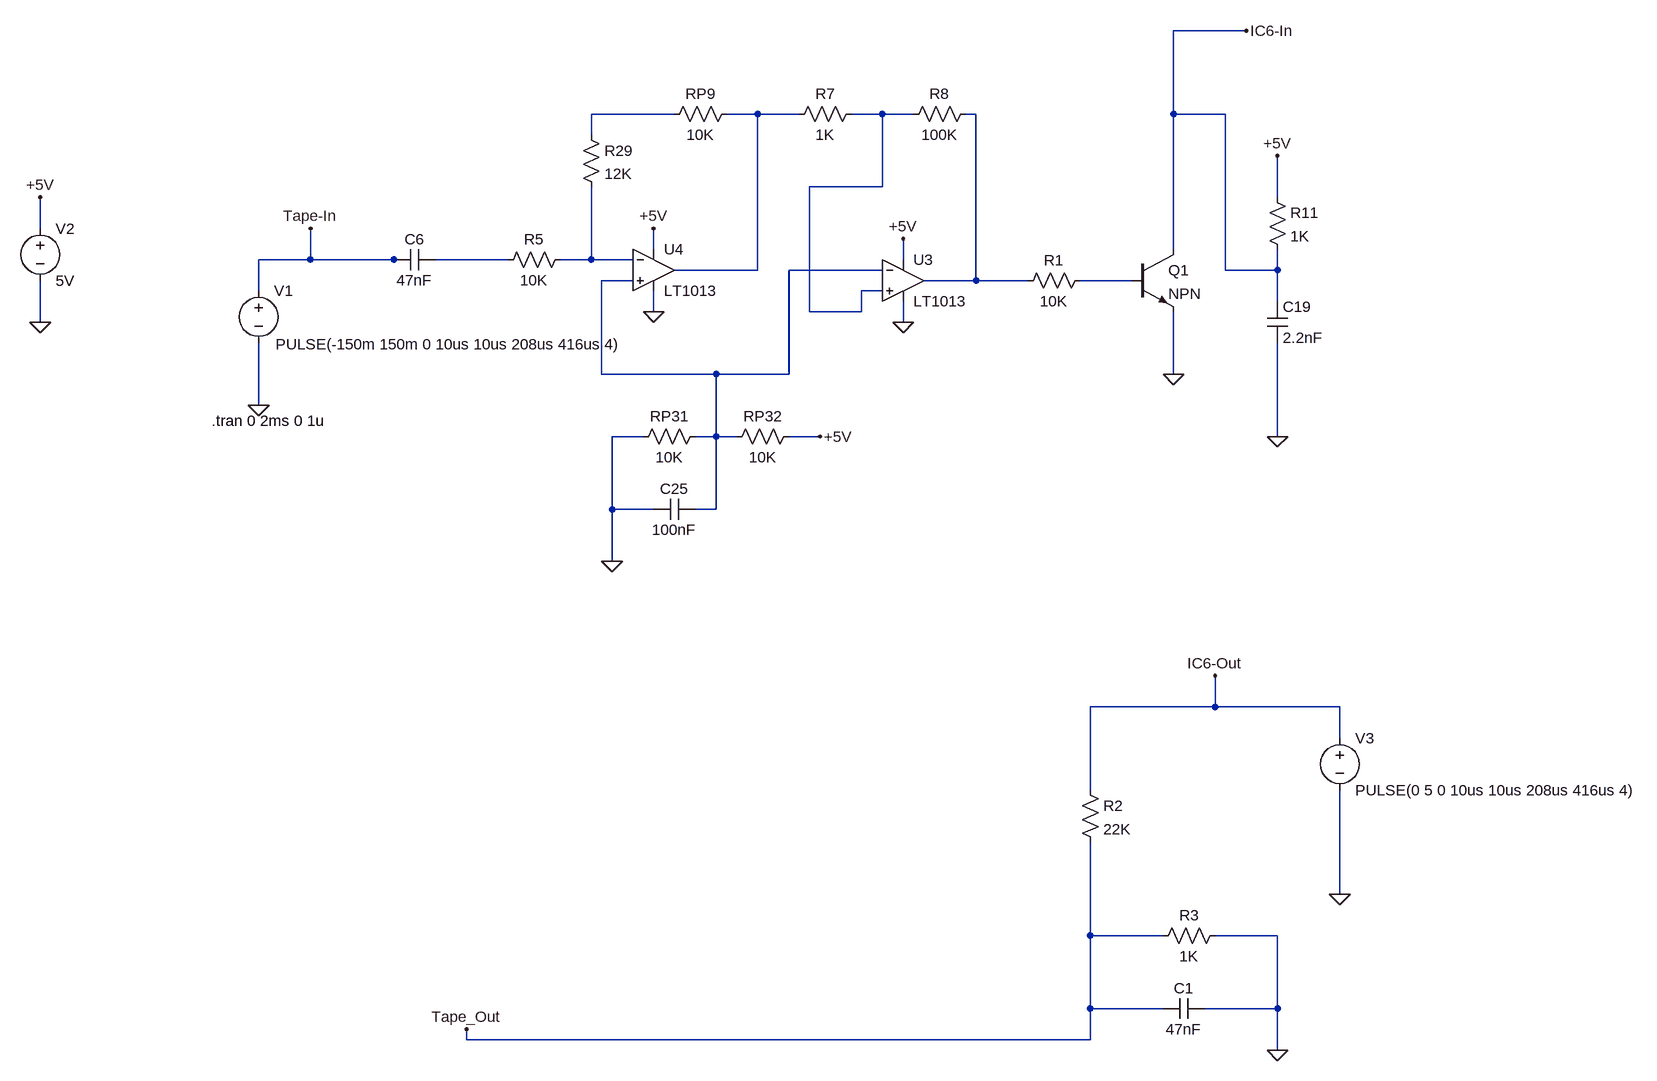
[diagram p0: schematic TapeInputOutput.asc]
TapeInputOutput.asc, the LTspice schematic file:
Version 4
SHEET 1 2020 1284
WIRE 1392 -304 1280 -304
WIRE 512 -176 384 -176
WIRE 640 -176 592 -176
WIRE 704 -176 640 -176
WIRE 832 -176 784 -176
WIRE 880 -176 832 -176
WIRE 976 -176 960 -176
WIRE 1280 -176 1280 -304
WIRE 1360 -176 1280 -176
WIRE 384 -144 384 -176
WIRE 832 -64 832 -176
WIRE 832 -64 720 -64
WIRE 1440 -48 1440 -112
WIRE -464 0 -464 -48
WIRE 480 32 480 0
WIRE 1280 32 1280 -176
WIRE -48 48 -48 0
WIRE -48 48 -128 48
WIRE 80 48 -48 48
WIRE 96 48 80 48
WIRE 256 48 144 48
WIRE 384 48 384 -64
WIRE 384 48 336 48
WIRE 448 48 384 48
WIRE 864 48 864 16
WIRE 640 64 640 -176
WIRE 640 64 512 64
WIRE 832 64 688 64
WIRE 1360 64 1360 -176
WIRE 1440 64 1440 32
WIRE 1440 64 1360 64
WIRE 448 80 400 80
WIRE 976 80 976 -176
WIRE 976 80 896 80
WIRE 1056 80 976 80
WIRE 1216 80 1136 80
WIRE -128 96 -128 48
WIRE 832 96 800 96
WIRE 1440 112 1440 64
WIRE 480 128 480 96
WIRE 720 128 720 -64
WIRE 800 128 800 96
WIRE 800 128 720 128
WIRE -464 144 -464 80
WIRE 864 144 864 112
WIRE 400 224 400 80
WIRE 576 224 400 224
WIRE 688 224 688 64
WIRE 688 224 576 224
WIRE 1280 224 1280 128
WIRE -128 272 -128 176
WIRE 464 320 416 320
WIRE 576 320 576 224
WIRE 576 320 544 320
WIRE 608 320 576 320
WIRE 736 320 688 320
WIRE 1440 320 1440 176
WIRE 416 432 416 320
WIRE 480 432 416 432
WIRE 576 432 576 320
WIRE 576 432 544 432
WIRE 416 512 416 432
WIRE 1344 736 1344 688
WIRE 1344 736 1152 736
WIRE 1536 736 1344 736
WIRE 1536 784 1536 736
WIRE 1152 864 1152 736
WIRE 1536 1024 1536 864
WIRE 1152 1088 1152 944
WIRE 1264 1088 1152 1088
WIRE 1440 1088 1344 1088
WIRE 1152 1200 1152 1088
WIRE 1264 1200 1152 1200
WIRE 1440 1200 1440 1088
WIRE 1440 1200 1328 1200
WIRE 192 1248 192 1232
WIRE 1152 1248 1152 1200
WIRE 1152 1248 192 1248
WIRE 1440 1264 1440 1200
FLAG -128 272 0
FLAG -464 144 0
FLAG -464 -48 +5V
FLAG 416 512 0
FLAG 736 320 +5V
FLAG 1440 -112 +5V
FLAG 1440 320 0
FLAG 1392 -304 IC6-In
FLAG 1280 224 0
FLAG 480 0 +5V
FLAG 864 16 +5V
FLAG 480 128 0
FLAG 864 144 0
FLAG 1536 1024 0
FLAG 1440 1264 0
FLAG 192 1232 Tape_Out
FLAG -48 0 Tape-In
FLAG 1344 688 IC6-Out
SYMBOL cap 144 32 R90
WINDOW 0 0 32 VBottom 2
WINDOW 3 32 32 VTop 2
SYMATTR InstName C6
SYMATTR Value 47nF
SYMBOL res 352 32 R90
WINDOW 0 0 56 VBottom 2
WINDOW 3 32 56 VTop 2
SYMATTR InstName R5
SYMATTR Value 10K
SYMBOL voltage -128 80 R0
WINDOW 3 26 98 Left 2
WINDOW 123 0 0 Left 0
WINDOW 39 0 0 Left 0
SYMATTR Value PULSE(-150m 150m 0 10us 10us 208us 416us 4)
SYMATTR InstName V1
SYMBOL voltage -464 -16 R0
WINDOW 123 0 0 Left 0
WINDOW 39 0 0 Left 0
SYMATTR InstName V2
SYMATTR Value 5V
SYMBOL res 560 304 R90
WINDOW 0 0 56 VBottom 2
WINDOW 3 32 56 VTop 2
SYMATTR InstName RP31
SYMATTR Value 10K
SYMBOL res 704 304 R90
WINDOW 0 0 56 VBottom 2
WINDOW 3 32 56 VTop 2
SYMATTR InstName RP32
SYMATTR Value 10K
SYMBOL cap 544 416 R90
WINDOW 0 0 32 VBottom 2
WINDOW 3 32 32 VTop 2
SYMATTR InstName C25
SYMATTR Value 100nF
SYMBOL res 368 -160 R0
SYMATTR InstName R29
SYMATTR Value 12K
SYMBOL res 608 -192 R90
WINDOW 0 0 56 VBottom 2
WINDOW 3 32 56 VTop 2
SYMATTR InstName RP9
SYMATTR Value 10K
SYMBOL res 800 -192 R90
WINDOW 0 0 56 VBottom 2
WINDOW 3 32 56 VTop 2
SYMATTR InstName R7
SYMATTR Value 1K
SYMBOL res 976 -192 R90
WINDOW 0 0 56 VBottom 2
WINDOW 3 32 56 VTop 2
SYMATTR InstName R8
SYMATTR Value 100K
SYMBOL res 1152 64 R90
WINDOW 0 0 56 VBottom 2
WINDOW 3 32 56 VTop 2
SYMATTR InstName R1
SYMATTR Value 10K
SYMBOL res 1424 -64 R0
SYMATTR InstName R11
SYMATTR Value 1K
SYMBOL cap 1424 112 R0
SYMATTR InstName C19
SYMATTR Value 2.2nF
SYMBOL npn 1216 32 R0
SYMATTR InstName Q1
SYMBOL res 1136 848 R0
SYMATTR InstName R2
SYMATTR Value 22K
SYMBOL res 1360 1072 R90
WINDOW 0 0 56 VBottom 2
WINDOW 3 32 56 VTop 2
SYMATTR InstName R3
SYMATTR Value 1K
SYMBOL cap 1328 1184 R90
WINDOW 0 0 32 VBottom 2
WINDOW 3 32 32 VTop 2
SYMATTR InstName C1
SYMATTR Value 47nF
SYMBOL voltage 1536 768 R0
WINDOW 123 0 0 Left 0
WINDOW 39 0 0 Left 0
SYMATTR InstName V3
SYMATTR Value PULSE(0 5 0 10us 10us 208us 416us 4)
SYMBOL Opamps\\LT1013 864 16 R0
SYMATTR InstName U3
SYMBOL Opamps\\LT1013 480 0 R0
SYMATTR InstName U4
TEXT -200 296 Left 2 !.tran 0 2ms 0 1u

The netlist it stands for:
* TapeInputOutput.asc
C6 N005 Tape-In 47nF
R5 N006 N005 10K
V1 Tape-In 0 PULSE(-150m 150m 0 10us 10us 208us 416us 4)
V2 +5V 0 5V
RP31 N007 0 10K
RP32 +5V N007 10K
C25 N007 0 100nF
R29 N001 N006 12K
RP9 N002 N001 10K
R7 N003 N002 1K
R8 N004 N003 100K
R1 N008 N004 10K
R11 +5V IC6-In 1K
C19 IC6-In 0 2.2nF
Q1 IC6-In N008 0 0 NPN
R2 IC6-Out Tape_Out 22K
R3 0 Tape_Out 1K
C1 0 Tape_Out 47nF
V3 IC6-Out 0 PULSE(0 5 0 10us 10us 208us 416us 4)
XU3 N003 N007 +5V 0 N004 LT1013  ; pins In+ In- V+ V- OUT
XU4 N007 N006 +5V 0 N002 LT1013  ; pins In+ In- V+ V- OUT
.model NPN NPN
.model PNP PNP
.lib standard.bjt
.tran 0 2ms 0 1u
.lib LTC.lib
.backanno
.end